# EAGLE design STM32F413CG_WM8731 (EAGLE 9.6.2)

## Sheet 1 of 3
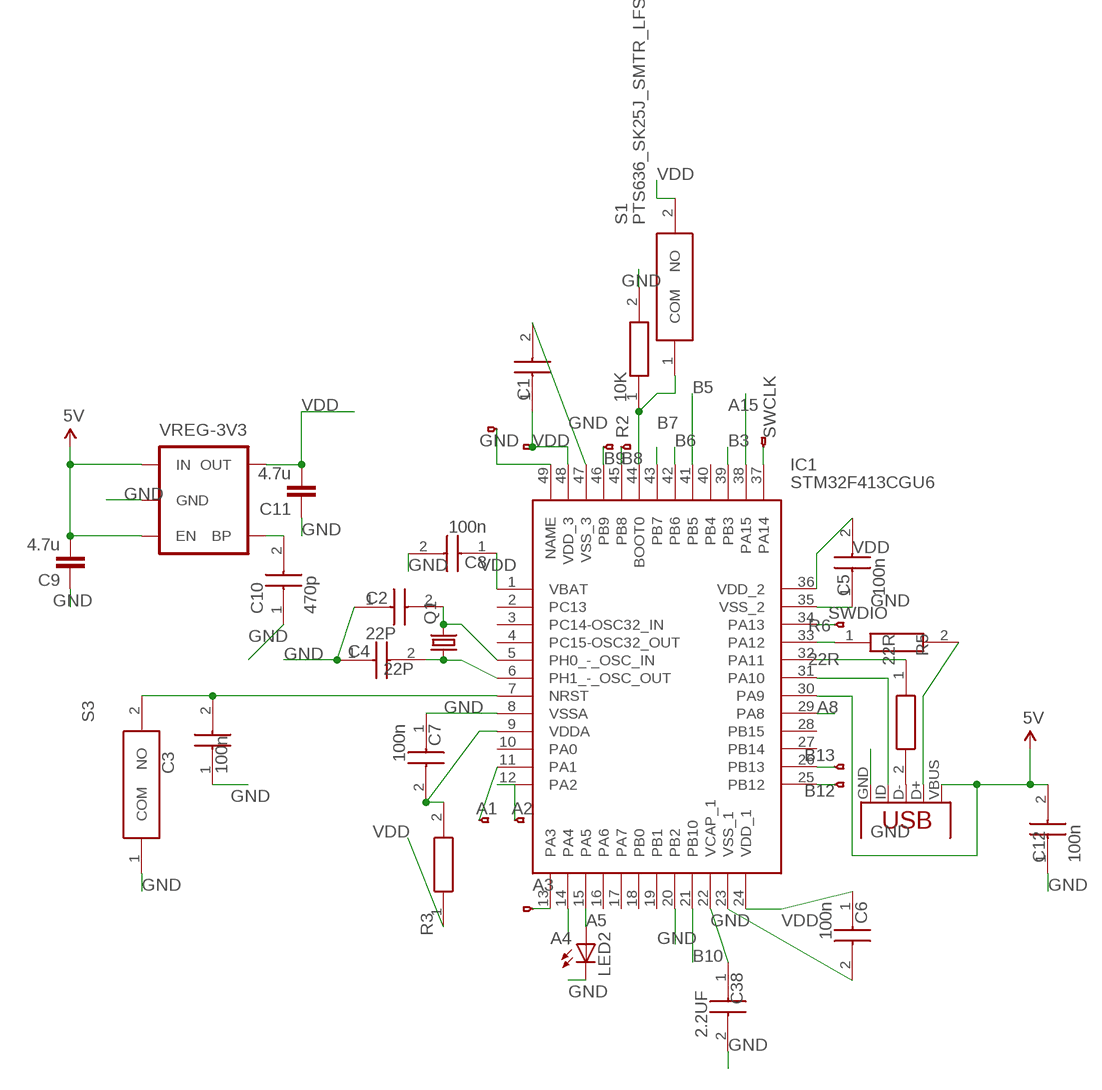
[diagram p0: schematic, sheet 1]

### Parts
C1  C0603C104M4RAC7411  [CAPC1608X95N]
C2  22P  C1608C0G1H150J080AA  [CAPC1608X80N]
C3  100n  C0603C104M4RAC7411  [CAPC1608X95N]
C4  22P  C1608C0G1H150J080AA  [CAPC1608X80N]
C5  100n  C0603C104M4RAC7411  [CAPC1608X95N]
C6  100n  C0603C104M4RAC7411  [CAPC1608X95N]
C7  100n  C0603C104M4RAC7411  [CAPC1608X95N]
C8  100n  C0603C104M4RAC7411  [CAPC1608X95N]
C9  4.7u  C2,5-3  [C2.5-3]
C10  470p  C0603C471K3RACTU  [CAPC1608X87N]
C11  4.7u  C2,5-3  [C2.5-3]
C12  100n  C0603C104M4RAC7411  [CAPC1608X95N]
C38  2.2UF  C2012X7R1E225K125AB  [CAPC2012X145N]
IC1  STM32F413CGU6  [QFN50P700X700X60-49N]
JP1  HEADERHOLE-HEADERHOLE  [1X1-HEADER-HOLE]
JP2  HEADERHOLE-HEADERHOLE  [1X1-HEADER-HOLE]
JP3  HEADERHOLE-HEADERHOLE  [1X1-HEADER-HOLE]
JP4  HEADERHOLE-HEADERHOLE  [1X1-HEADER-HOLE]
JP5  HEADERHOLE-HEADERHOLE  [1X1-HEADER-HOLE]
JP6  HEADERHOLE-HEADERHOLE  [1X1-HEADER-HOLE]
JP7  HEADERHOLE-HEADERHOLE  [1X1-HEADER-HOLE]
JP8  HEADERHOLE-HEADERHOLE  [1X1-HEADER-HOLE]
JP9  HEADERHOLE-HEADERHOLE  [1X1-HEADER-HOLE]
JP10  HEADERHOLE-HEADERHOLE  [1X1-HEADER-HOLE]
JP11  HEADERHOLE-HEADERHOLE  [1X1-HEADER-HOLE]
LED2  LED0603  [LED-0603]
Q1  CRYSTALHC49S  [HC49/S]
R2  10K  CRCW040210K0JNED  [RESC1005X40N]
R3  CRCW040222R0FKED  [RESC1005X40N]
R5  22R  CRCW040222R0FKED  [RESC1005X40N]
R6  22R  CRCW040222R0FKED  [RESC1005X40N]
S1  PTS636_SK25J_SMTR_LFS  [PTS636SK25JSMTRLFS]
S3  PTS636_SK25J_SMTR_LFS  [PTS636SK25JSMTRLFS]
VREG-3V3  V_REG_LDOSMD  [SOT23-5]
X1  USB-MICROB-SMD  [USB-MICROB-SMD]

### Nets
5V: C9.2 C12.2 IC1.30(PA9) VREG-3V3.1(IN) VREG-3V3.3(EN) X1.VBUS
A1: IC1.11(PA1) JP8.1
A2: IC1.12(PA2) JP9.1
A3: IC1.13(PA3) JP10.1
A4: IC1.14(PA4) ; also sheet 2
A5: IC1.15(PA5) LED2.A
A8: IC1.29(PA8) ; also sheet 2
A15: IC1.38(PA15) ; also sheet 3
B3: IC1.39(PB3) ; also sheet 3
B5: IC1.41(PB5) ; also sheet 3
B6: IC1.42(PB6) ; also sheet 3
B7: IC1.43(PB7) ; also sheet 3
B8: IC1.45(PB8) JP5.1
B9: IC1.46(PB9) JP11.1
B10: IC1.21(PB10) ; also sheet 3
B12: IC1.25(PB12) JP7.1
B13: IC1.26(PB13) JP6.1
GND: C1.2 C2.1 C3.1 C4.1 C5.1 C6.2 C7.1 C8.2 C9.1 C10.1 C11.1 C12.1 C38.2 IC1.8(VSSA) IC1.20(PB2) IC1.23(VSS_1) IC1.35(VSS_2) IC1.47(VSS_3) IC1.49(NAME) JP1.1 LED2.C R2.2 S3.1(COM) VREG-3V3.2(GND) X1.GND ; also sheet 2,3
N$1: C2.2 IC1.5(PH0_-_OSC_IN) Q1.2
N$3: C3.2 IC1.7(NRST) S3.2(NO)
N$4: C10.2 VREG-3V3.4(BP)
N$5: C7.2 IC1.9(VDDA) R3.2
N$7: R5.2 X1.D-
N$8: IC1.31(PA10) X1.ID
N$9: IC1.32(PA11) R5.1
N$10: R6.2 X1.D+
N$11: IC1.33(PA12) R6.1
N$13: IC1.44(BOOT0) R2.1 S1.1(COM)
N$19: C4.2 IC1.6(PH1_-_OSC_OUT) Q1.1
N$48: C38.1 IC1.22(VCAP_1)
SWCLK: IC1.37(PA14) JP2.1
SWDIO: IC1.34(PA13) JP3.1
VDD: C1.1 C5.2 C6.1 C8.1 C11.2 IC1.1(VBAT) IC1.24(VDD_1) IC1.36(VDD_2) IC1.48(VDD_3) JP4.1 R3.1 S1.2(NO) VREG-3V3.5(OUT) ; also sheet 2,3
Unconnected: IC1.2(PC13) IC1.3(PC14-OSC32_IN) IC1.4(PC15-OSC32_OUT) IC1.10(PA0) IC1.16(PA6) IC1.17(PA7) IC1.18(PB0) IC1.19(PB1) IC1.27(PB14) IC1.28(PB15) IC1.40(PB4) X1.MT1 X1.MT2 X1.MT3 X1.MT4

## Sheet 2 of 3
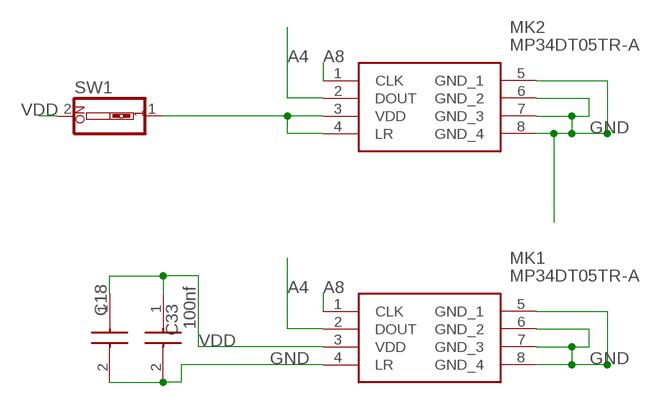
[diagram p1: schematic, sheet 2]

### Parts
C18  1UF  CC0402KRX5R6BB105  [CAPC1005X55N]
C33  100nf  C0603C104M4RAC7411  [CAPC1608X95N]
MK1  MP34DT05TR-A  [MP34DT05TRA]
MK2  MP34DT05TR-A  [MP34DT05TRA]
SW1  SW_DIP-1  [EDG-01]

### Nets
A4: MK1.2(DOUT) MK2.2(DOUT) ; also sheet 1
A8: MK1.1(CLK) MK2.1(CLK) ; also sheet 1
GND: C18.2(C2) C33.2 MK1.4(LR) MK1.5(GND_1) MK1.6(GND_2) MK1.7(GND_3) MK1.8(GND_4) MK2.5(GND_1) MK2.6(GND_2) MK2.7(GND_3) MK2.8(GND_4) ; also sheet 1,3
N$2: MK2.3(VDD) MK2.4(LR) SW1.1
VDD: C18.1(C1) C33.1 MK1.3(VDD) SW1.2 ; also sheet 1,3

## Sheet 3 of 3
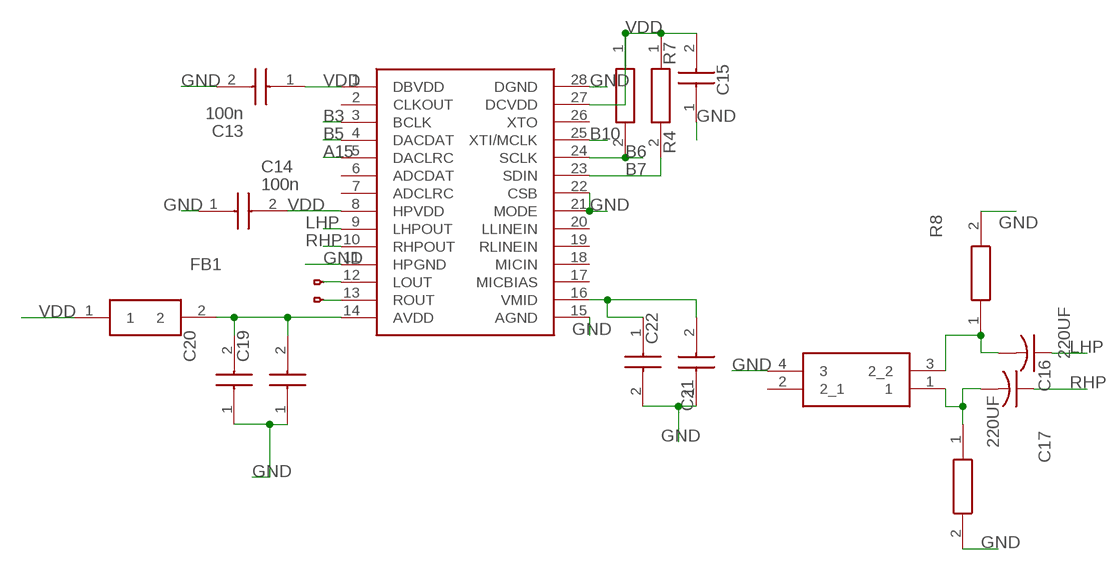
[diagram p2: schematic, sheet 3]

### Parts
C13  100n  C0603C104M4RAC7411  [CAPC1608X95N]
C14  100n  C0603C104M4RAC7411  [CAPC1608X95N]
C15  C0603C104M4RAC7411  [CAPC1608X95N]
C16  220UF  C-US025-024X044  [C025-024X044]
C17  220UF  C-US025-024X044  [C025-024X044]
C19  C0603C104M4RAC7411  [CAPC1608X95N]
C20  CL21A106KAYNNNE_10UF  CL21A106KAYNNNE  [CAPC2012X145N]
C21  CL21A106KAYNNNE  [CAPC2012X145N]
C22  C0603C104M4RAC7411  [CAPC1608X95N]
FB1  BLM18BD252SN1D  [BEADC1608X95N]
IC2  WM8731SEDS_RV  [SOP65P780X200-28N]
J2  1503_02  [150302]
JP12  HEADERHOLE-HEADERHOLE  [1X1-HEADER-HOLE]
JP13  HEADERHOLE-HEADERHOLE  [1X1-HEADER-HOLE]
R4  CR0603-JW-472ELF  [RESC1608X55N]
R7  CR0603-JW-472ELF  [RESC1608X55N]
R8  CR0603-JW-472ELF  [RESC1608X55N]
R9  CR0603-JW-472ELF  [RESC1608X55N]

### Nets
A15: IC2.5(DACLRC) ; also sheet 1
B3: IC2.3(BCLK) ; also sheet 1
B5: IC2.4(DACDAT) ; also sheet 1
B6: IC2.24(SCLK) R4.2 ; also sheet 1
B7: IC2.23(SDIN) R7.2 ; also sheet 1
B10: IC2.25(XTI/MCLK) ; also sheet 1
GND: C13.2 C14.1 C15.1 C19.1 C20.1 C21.2 C22.1 IC2.11(HPGND) IC2.15(AGND) IC2.21(MODE) IC2.22(CSB) IC2.28(DGND) J2.4 R8.2 R9.2 ; also sheet 1,2
LHP: C16.1 IC2.9(LHPOUT)
N$6: C16.2 J2.3(2_2) R8.1
N$12: C19.2 C20.2 FB1.2 IC2.14(AVDD)
N$14: C21.1 C22.2 IC2.16(VMID)
N$15: IC2.12(LOUT) JP13.1
N$16: IC2.13(ROUT) JP12.1
N$25: C17.2 J2.1 R9.1
RHP: C17.1 IC2.10(RHPOUT)
VDD: C13.1 C14.2 C15.2 FB1.1 IC2.1(DBVDD) IC2.8(HPVDD) IC2.27(DCVDD) R4.1 R7.1 ; also sheet 1,2
Unconnected: IC2.2(CLKOUT) IC2.6(ADCDAT) IC2.7(ADCLRC) IC2.17(MICBIAS) IC2.18(MICIN) IC2.19(RLINEIN) IC2.20(LLINEIN) IC2.26(XTO) J2.2(2_1)

## Library data of the parts
C1 C3 C5-C8 C12-C15 C33 = C0603C104M4RAC7411:C0603C104M4RAC7411: KEMET - C0603C104M4RAC7411 - CAP, 0.1F, 16V, 20%, X7R, 0603 Source: Datasheet <https://www.mouser.com/datasheet/2/212/KEM_C1023_X7R_AUTO_SMD-1093309.pdf>; DESCRIPTION: KEMET - C0603C104M4RAC7411 - CAP, 0.1F, 16V, 20%, X7R, 0603; HEIGHT: 0.95mm; MANUFACTURER_NAME: Kemet; MANUFACTURER_PART_NUMBER: C0603C104M4RAC7411; MOUSER_PART_NUMBER: 80-C0603C104M4R7411; MOUSER_PRICE-STOCK: https://www.mouser.com/Search/Refine.aspx?Keyword=80-C0603C104M4R7411
C2 C4 = C1608C0G1H150J080AA_15pF:C1608C0G1H150J080AA: TDK 0603 C 15pF Ceramic Multilayer Capacitor, 50 V dc, +125C, C0G Dielectric, +/-5% SMD Source: Datasheet <https://product.tdk.com/info/en/catalog/datasheets/mlcc_commercial_midvoltage_en.pdf>; DESCRIPTION: TDK 0603 C 15pF Ceramic Multilayer Capacitor, 50 V dc, +125C, C0G Dielectric, +/-5% SMD; HEIGHT: 0.8mm; MANUFACTURER_NAME: TDK; MANUFACTURER_PART_NUMBER: C1608C0G1H150J080AA; MOUSER_PART_NUMBER: 810-C1608C0G1H150J; MOUSER_PRICE-STOCK: https://www.mouser.com/Search/Refine.aspx?Keyword=810-C1608C0G1H150J; RS_PART_NUMBER: 7882935; RS_PRICE-STOCK: https://uk.rs-online.com/web/p/products/7882935
C9 C11 = capacitor-wima:C: CAPACITOR naming: grid - package width
C10 = C0603C471K3RACTU_470pF:C0603C471K3RACTU: KEMET - C0603C471K3RACTU - CAP, X7R, 470PF, 25V, 0603 Source: Datasheet <https://api.kemet.com/component-edge/download/specsheet/C0603C471K3RACTU.pdf>; DESCRIPTION: KEMET - C0603C471K3RACTU - CAP, X7R, 470PF, 25V, 0603; HEIGHT: 0.87mm; MANUFACTURER_NAME: Kemet; MANUFACTURER_PART_NUMBER: C0603C471K3RACTU; MOUSER_PART_NUMBER: 80-C0603C471K3R; MOUSER_PRICE-STOCK: https://www.mouser.com/Search/Refine.aspx?Keyword=80-C0603C471K3R
C16 C17 = rcl:C-US: CAPACITOR, American symbol; SPICEPREFIX: C
C18 = CC0402KRX5R6BB105_1UF:CC0402KRX5R6BB105: CAPACITOR, 0402 1uF +/-10% 10V Source: Datasheet <http://componentsearchengine.com/Datasheets/1/CC0402KRX5R6BB105.pdf>; DESCRIPTION: CAPACITOR, 0402 1uF +/-10% 10V; HEIGHT: mm; MANUFACTURER_NAME: YAGEO (PHYCOMP); MANUFACTURER_PART_NUMBER: CC0402KRX5R6BB105; MOUSER_PART_NUMBER: 603-CC402KRX5R6BB105; MOUSER_PRICE-STOCK: https://www.mouser.com/Search/Refine.aspx?Keyword=603-CC402KRX5R6BB105
C19 C22 = C0603C104M4RAC7411_100nF:C0603C104M4RAC7411: KEMET - C0603C104M4RAC7411 - CAP, 0.1F, 16V, 20%, X7R, 0603 Source: Datasheet <https://www.mouser.com/datasheet/2/212/KEM_C1023_X7R_AUTO_SMD-1093309.pdf>; DESCRIPTION: KEMET - C0603C104M4RAC7411 - CAP, 0.1F, 16V, 20%, X7R, 0603; HEIGHT: 0.95mm; MANUFACTURER_NAME: Kemet; MANUFACTURER_PART_NUMBER: C0603C104M4RAC7411; MOUSER_PART_NUMBER: 80-C0603C104M4R7411; MOUSER_PRICE-STOCK: https://www.mouser.com/Search/Refine.aspx?Keyword=80-C0603C104M4R7411
C20 C21 = CL21A106KAYNNNE_10uF:CL21A106KAYNNNE: Samsung Source: Datasheet <http://www.samsungsem.com/kr/support/library/product-catalog/__icsFiles/afieldfile/2017/09/13/MLCC.pdf>; DESCRIPTION: Samsung; HEIGHT: 1.45mm; MANUFACTURER_NAME: Samsung Electro-Mechanics; MANUFACTURER_PART_NUMBER: CL21A106KAYNNNE; MOUSER_PART_NUMBER: N/A; MOUSER_PRICE-STOCK: https://www.mouser.com/Search/Refine.aspx?Keyword=N%2FA
C38 = C2012X7R1E225K125AB:C2012X7R1E225K125AB: TDK - C2012X7R1E225K125AB - CAPACITOR, MLCC, X7R, 2.2UF, 25V, 0805 Source: Datasheet <https://product.tdk.com/info/en/catalog/datasheets/mlcc_commercial_midvoltage_en.pdf>; DESCRIPTION: TDK - C2012X7R1E225K125AB - CAPACITOR, MLCC, X7R, 2.2UF, 25V, 0805; HEIGHT: 1.45mm; MANUFACTURER_NAME: TDK; MANUFACTURER_PART_NUMBER: C2012X7R1E225K125AB; MOUSER_PART_NUMBER: 810-C2012X7R1E225K; MOUSER_PRICE-STOCK: https://www.mouser.com/Search/Refine.aspx?Keyword=810-C2012X7R1E225K; RS_PART_NUMBER: 9159394P; RS_PRICE-STOCK: http://uk.rs-online.com/web/p/products/9159394P
FB1 = BLM18BD252SN1D_Ferrite Bead:BLM18BD252SN1D: 0603 Ferrite Bead,2K5,25%,50mA,1R5 Murata Ferrite Bead (Chip Ferrite Bead), 1.6 x 0.8 x 0.8mm (0603), 2500 impedance at 100 MHz Source: Datasheet <http://www.murata.com/~/media/webrenewal/support/library/catalog/products/emc/emifil/c31e.ashx?la=en-gb>; DESCRIPTION: 0603 Ferrite Bead,2K5,25%,50mA,1R5 Murata Ferrite Bead (Chip Ferrite Bead), 1.6 x 0.8 x 0.8mm (0603), 2500 impedance at 100 MHz; HEIGHT: 0.95mm; MANUFACTURER_NAME: Murata Electronics; MANUFACTURER_PART_NUMBER: BLM18BD252SN1D; MOUSER_PART_NUMBER: 81-BLM18BD252SN1D; MOUSER_PRICE-STOCK: https://www.mouser.com/Search/Refine.aspx?Keyword=81-BLM18BD252SN1D; RS_PART_NUMBER: 7241321P; RS_PRICE-STOCK: http://uk.rs-online.com/web/p/products/7241321P
IC1 = STM32F413CG_edited:STM32F413CGU6: STMICROELECTRONICS - STM32F413CGU6 - MCU, ARM CORTEX-M4, 100MHZ, UFQFPN-48 Source: Datasheet <http://www.st.com/content/ccc/resource/technical/document/datasheet/group3/f6/1d/4a/d9/f9/96/43/2a/DM00282249/files/DM00282249.pdf/jcr:content/translations/en.DM00282249.pdf>; DESCRIPTION: STMICROELECTRONICS - STM32F413CGU6 - MCU, ARM CORTEX-M4, 100MHZ, UFQFPN-48; HEIGHT: 0.6mm; MANUFACTURER_NAME: STMicroelectronics; MANUFACTURER_PART_NUMBER: STM32F413CGU6; MOUSER_PART_NUMBER: 511-STM32F413CGU6; MOUSER_PRICE-STOCK: https://www.mouser.com/Search/Refine.aspx?Keyword=511-STM32F413CGU6
IC2 = WM8731SEDS_RV_1:WM8731SEDS_RV: WOLFSON MICROELECTRONICS - WM8731SEDS/RV - DAC, AUDIO, 24BIT, HEADPHONE, 28SSOP Source: Datasheet <https://d3uzseaevmutz1.cloudfront.net/pubs/proDatasheet/WM8731_v4.9.pdf>; DESCRIPTION: WOLFSON MICROELECTRONICS - WM8731SEDS/RV - DAC, AUDIO, 24BIT, HEADPHONE, 28SSOP; HEIGHT: 2mm; MANUFACTURER_NAME: WOLFSON MICROELECTRONICS; MANUFACTURER_PART_NUMBER: WM8731SEDS/RV
J2 = 1503_02:1503_02: LUMBERG - 1503 02 - CONNECTOR, RECEPTACLE, 3.5MM PHONO, 3WAY Source: Datasheet <http://www.farnell.com/datasheets/2047485.pdf>; DESCRIPTION: LUMBERG - 1503 02 - CONNECTOR, RECEPTACLE, 3.5MM PHONO, 3WAY; HEIGHT: 5mm; MANUFACTURER_NAME: LUMBERG; MANUFACTURER_PART_NUMBER: 1503 02
JP1-JP13 = F405Pill:HEADERHOLE
LED2 = F405Pill:LED: LEDs Standard schematic elements and footprints for 5mm, 3mm, 1206, and 0603 sized LEDs. 5mm - Spark Fun Electronics SKU : COM-00529 (and others)
MK1 MK2 = MP34DT05TR-A:MP34DT05TR-A: STMICROELECTRONICS - MP34DT05TR-A - MEMS MICROPHONE, 3.6V, HCLGA-4 Source: Datasheet <http://www.st.com/content/ccc/resource/technical/document/datasheet/group3/c7/90/d3/f6/b7/e7/40/c8/DM00415595/files/DM00415595.pdf/jcr:content/translations/en.DM00415595.pdf>; DESCRIPTION: STMICROELECTRONICS - MP34DT05TR-A - MEMS MICROPHONE, 3.6V, HCLGA-4; HEIGHT: 1mm; MANUFACTURER_NAME: STMicroelectronics; MANUFACTURER_PART_NUMBER: MP34DT05TR-A; MOUSER_PART_NUMBER: 511-MP34DT05TR-A; MOUSER_PRICE-STOCK: https://www.mouser.com/Search/Refine.aspx?Keyword=511-MP34DT05TR-A
Q1 = crystal:CRYSTAL: CRYSTAL; OC_FARNELL: 1667008; OC_NEWARK: unknown
R2 = CRCW040210K0JNED:CRCW040210K0JNED: Thick Film Resistors - SMD 1/16watt 10Kohms 5% Source: Datasheet <http://www.vishay.com/docs/20035/dcrcwe3.pdf>; ALLIED_NUMBER: 70202522; ALLIED_PRICE-STOCK: https://www.alliedelec.com/vishay-dale-crcw040210k0jned/70202522/; DESCRIPTION: Thick Film Resistors - SMD 1/16watt 10Kohms 5%; HEIGHT: 0.4mm; MANUFACTURER_NAME: Vishay; MANUFACTURER_PART_NUMBER: CRCW040210K0JNED; MOUSER_PART_NUMBER: 71-CRCW0402J-10K-E3; MOUSER_PRICE-STOCK: https://www.mouser.com/Search/Refine.aspx?Keyword=71-CRCW0402J-10K-E3
R3 R5 R6 = CRCW040222R0FKED_22R:CRCW040222R0FKED: Vishay CRCW Series Thick Film Surface Mount Resistor 0402 Case 22 +/-1% 0.063W +/-100ppm/C Source: Datasheet <http://www.vishay.com/docs/20035/dcrcwe3.pdf>; ALLIED_NUMBER: 70202113; ALLIED_PRICE-STOCK: https://www.alliedelec.com/vishay-dale-crcw040222r0fked/70202113/; DESCRIPTION: Vishay CRCW Series Thick Film Surface Mount Resistor 0402 Case 22 +/-1% 0.063W +/-100ppm/C; HEIGHT: 0.4mm; MANUFACTURER_NAME: Vishay; MANUFACTURER_PART_NUMBER: CRCW040222R0FKED; MOUSER_PART_NUMBER: 71-CRCW0402-22-E3; MOUSER_PRICE-STOCK: https://www.mouser.com/Search/Refine.aspx?Keyword=71-CRCW0402-22-E3; RS_PART_NUMBER: 6788983P; RS_PRICE-STOCK: http://uk.rs-online.com/web/p/products/6788983P
R4 R7-R9 = CR0603-JW-472ELF:CR0603-JW-472ELF: BOURNS - CR0603-JW-472ELF - RES, THICK FILM, 4K7, 5%, 0.1W, 0603, REEL Source: Datasheet <https://www.bourns.com/pdfs/chpreztr.pdf>; ALLIED_NUMBER: 70154691; ALLIED_PRICE-STOCK: https://www.alliedelec.com/bourns-cr0603-jw-472elf/70154691/; DESCRIPTION: BOURNS - CR0603-JW-472ELF - RES, THICK FILM, 4K7, 5%, 0.1W, 0603, REEL; HEIGHT: 0.55mm; MANUFACTURER_NAME: Bourns; MANUFACTURER_PART_NUMBER: CR0603-JW-472ELF; MOUSER_PART_NUMBER: 652-CR0603-JW-472ELF; MOUSER_PRICE-STOCK: https://www.mouser.com/Search/Refine.aspx?Keyword=652-CR0603-JW-472ELF; RS_PART_NUMBER: 7408956P; RS_PRICE-STOCK: http://uk.rs-online.com/web/p/products/7408956P
S1 S3 = PTS636_SK25J_SMTR_LFS_tactSwitch6x3x2:PTS636_SK25J_SMTR_LFS: Tactile Switches Tact 50mA 12VDC, 6.0x3.5, 2.5mm H, 250gf, J leads, No ground pin, Red Actuator Source: Datasheet <https://www.mouser.com/datasheet/2/60/pts636-1550567.pdf>; DESCRIPTION: Tactile Switches Tact 50mA 12VDC, 6.0x3.5, 2.5mm H, 250gf, J leads, No ground pin, Red Actuator; HEIGHT: 2.7mm; MANUFACTURER_NAME: C & K COMPONENTS; MANUFACTURER_PART_NUMBER: PTS636 SK25J SMTR LFS; MOUSER_PART_NUMBER: 611-PTS636SK25JSMTRL; MOUSER_PRICE-STOCK: https://www.mouser.com/Search/Refine.aspx?Keyword=611-PTS636SK25JSMTRL
SW1 = special:SW_DIP-1: DIP SWITCH
VREG-3V3 = F405Pill:V_REG_LDO: Voltage Regulator LDO Standard 150mA LDO voltage regulator in SOT-23 layout. Micrel part MIC5205. BP (by-pass) pin is used to lower output noise with 470pF cap.
X1 = F405Pill:USB: USB Connectors USB-B-PTH is fully proven SKU : PRT-00139 USB-miniB is fully proven SKU : PRT-00587 USB-A-PCB is untested. USB-A-H is throughly reviewed, but untested. Spark Fun Electronics SKU : PRT-00437 USB-B-SMT is throughly reviewed, but untested. Needs silkscreen touching up. USB-A-S has not been used/tested USB-MB-H has not been used/tested

## Net classes
0 default: width 0.254 mm, drill 0.35 mm

## Board
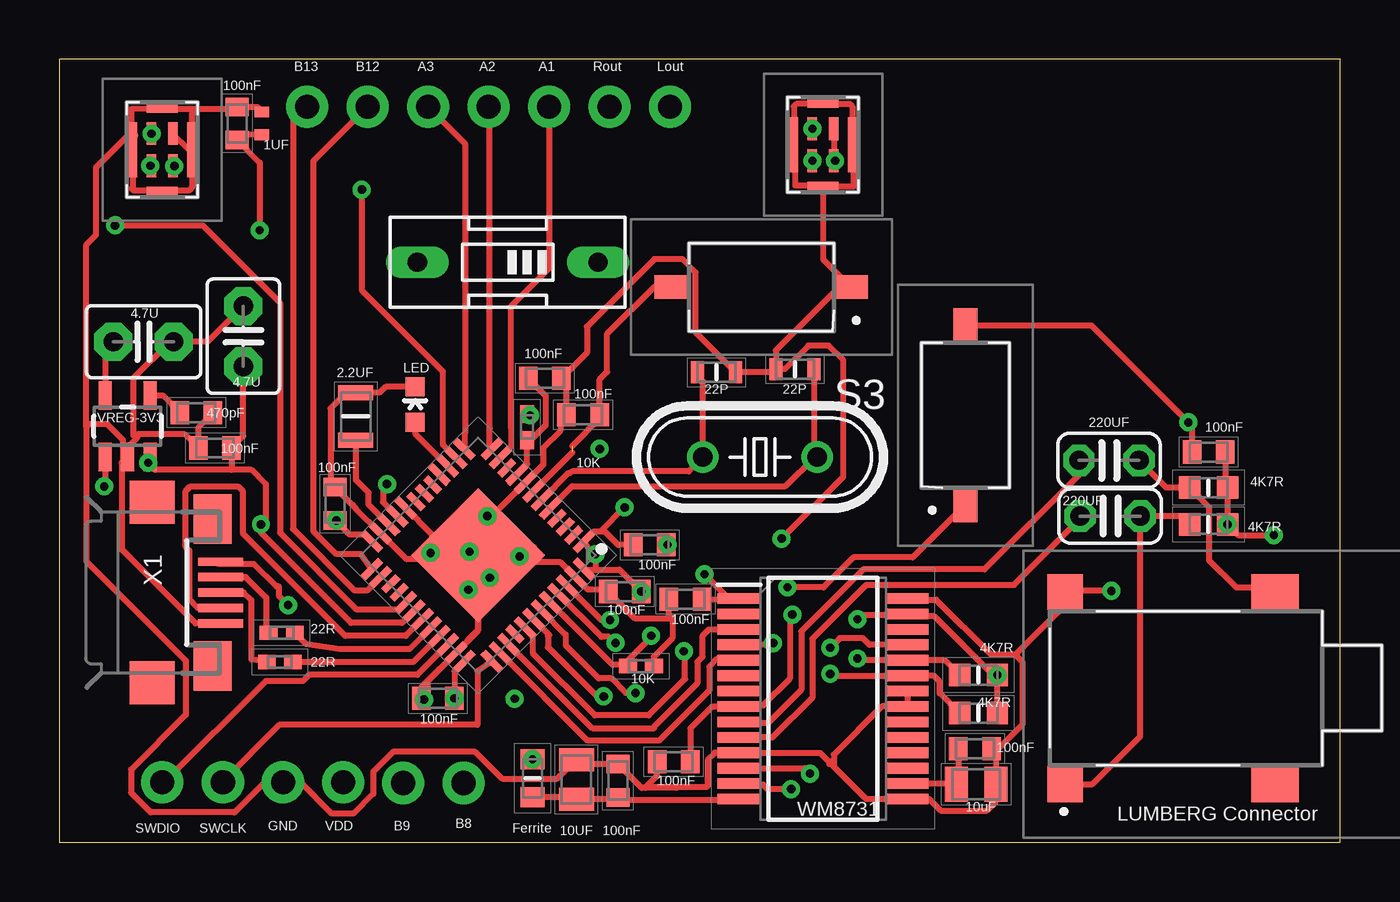
[diagram p3: board, top side]
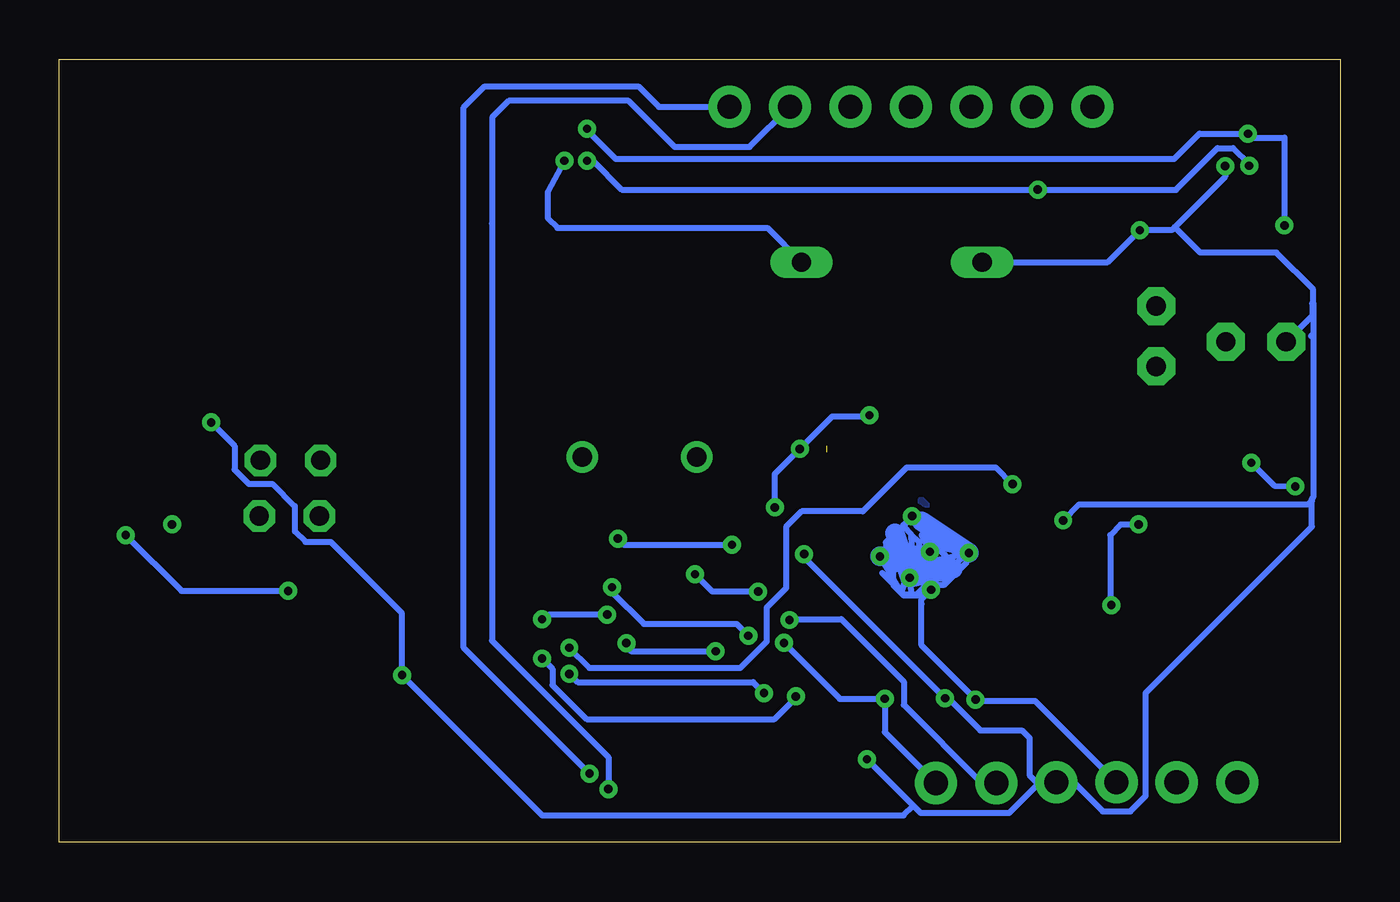
[diagram p4: board, bottom side, seen from below]

Size 54 x 33 mm. Coordinates in mm from the lower left corner, seen from the top.
Outline: 0,0 54,0 54,33 0,33 0,0
Copper layers (1*16): Top 0.035mm / dielectric 1.5mm / Bottom 0.035mm
Design rules "default *": minimum track width 6mil, minimum drill 0.35mm, track to track 0.2mm, track to pad 0.2mm, pad to pad 0.2mm, via to via 0.2mm, smd to smd 6mil, copper to edge 40mil, drill to drill 6mil, minimum pad ring 10mil, minimum via ring 8mil, stop-mask expansion 4mil, vias tented up to drill 0mil, thermal gap 10mil

### Footprints (pad centres in the part's own frame; a part is rotated, then mirrored left to right if it is on the bottom)
CAPC1608X95N = smd 0.78 x 0.98: 1 -0.7,0; 2 0.7,0
CAPC1608X80N = smd 0.54 x 0.94: 1 -0.8,0; 2 0.8,0
C2.5-3 = drill 0.813 pad 1.6 octagon: 1 -1.27,0; 2 1.27,0
CAPC1608X87N = smd 0.78 x 0.98: 1 -0.7,0; 2 0.7,0
C025-024X044 = drill 0.813 octagon: 1 -1.27,0; 2 1.27,0
CAPC1005X55N = smd 0.457 x 0.61: 1 -0.483,0; 2 0.483,0
CAPC2012X145N = smd 0.97 x 1.47: 1 -0.83,0; 2 0.83,0
CAPC2012X145N' = smd 0.62 x 1.47: 1 -1,0; 2 1,0
BEADC1608X95N = smd 0.85 x 1: 1 -0.8,0; 2 0.8,0
QFN50P700X700X60-49N = smd 1.08 x 0.3: 1 -3.57,2.75; 5 -3.567,0.75; 6 -3.567,0.25; 7 -3.567,-0.25; 8 -3.567,-0.75; 9 -3.567,-1.25; 11 -3.567,-2.25; 12 -3.59,-2.75; 25 3.59,-2.75; 26 3.567,-2.25; 29 3.567,-0.75; 30 3.567,-0.25; 31 3.567,0.25; 32 3.567,0.75; 33 3.567,1.25; 34 3.567,1.75; 35 3.567,2.25; 36 3.58,2.75 | smd 0.85 x 0.3: 2 -3.45,2.25; 3 -3.45,1.75; 4 -3.45,1.25; 10 -3.45,-1.75; 27 3.45,-1.75; 28 3.45,-1.25 | smd 0.3 x 1.08: 13 -2.75,-3.59; 14 -2.25,-3.567; 15 -1.75,-3.567; 16 -1.25,-3.567; 20 0.75,-3.567; 21 1.25,-3.567; 22 1.75,-3.567; 23 2.25,-3.567; 24 2.75,-3.59; 37 2.75,3.58; 38 2.25,3.567; 39 1.75,3.567; 41 0.75,3.567; 42 0.25,3.567; 43 -0.25,3.567; 44 -0.75,3.567; 45 -1.25,3.567; 46 -1.75,3.567; 47 -2.25,3.567; 48 -2.75,3.57 | smd 0.3 x 0.85: 17 -0.75,-3.45; 18 -0.25,-3.45; 19 0.25,-3.45; 40 1.25,3.45 | smd 4 x 4: 49 0,0
SOP65P780X200-28N = smd 1.8 x 0.45: 1 -3.55,4.225; 2 -3.55,3.575; 3 -3.55,2.925; 4 -3.55,2.275; 5 -3.55,1.625; 6 -3.55,0.975; 7 -3.55,0.325; 8 -3.55,-0.325; 9 -3.55,-0.975; 10 -3.55,-1.625; 11 -3.55,-2.275; 12 -3.55,-2.925; 13 -3.55,-3.575; 14 -3.55,-4.225; 15 3.55,-4.225; 16 3.55,-3.575; 17 3.55,-2.925; 18 3.55,-2.275; 19 3.55,-1.625; 20 3.55,-0.975; 21 3.55,-0.325; 22 3.55,0.325; 23 3.55,0.975; 24 3.55,1.625; 25 3.55,2.275; 26 3.55,2.925; 27 3.55,3.575; 28 3.55,4.225
150302 = smd 1.5 x 1.5: 1 6.3,3.8; 4 6.3,-4.3 | smd 2 x 1.5: 2 -2.55,3.8; 3 -2.55,-4.3
1X1-HEADER-HOLE = drill 1.016 pad 1.778: 1 0,0
LED-0603 = smd 0.8 x 0.8: A 0,-0.75; C 0,0.75
MP34DT05TRA = smd 0.4 x 0.95: 1 -0.45,0.675; 2 -0.45,-0.675; 3 0.45,-0.675; 4 0.45,0.675 | smd 0.35 x 2.3: 5 -1.225,0; 6 1.225,0 | smd 1.3 x 0.35: 7 0,1.725; 8 0,-1.725
HC49/S = drill 0.813: 1 -2.413,0; 2 2.413,0
RESC1005X40N = smd 0.75 x 0.6: 1 -0.55,0; 2 0.55,0
RESC1608X55N = smd 0.9 x 0.95: 1 -0.8,0; 2 0.8,0
PTS636SK25JSMTRLFS = smd 1.45 x 1: 1 -3.775,0; 2 3.775,0
EDG-01 = drill 0.813 long: 1 0,-3.81; 2 0,3.81
SOT23-5 = smd 0.55 x 1.2: 1 -0.95,-1.3; 2 0,-1.3; 3 0.95,-1.3; 4 0.95,1.3; 5 -0.95,1.3
USB-MICROB-SMD = smd 0.35 x 1.9: D+ 0,2.9; D- -0.65,2.9; GND 1.3,2.9; ID 0.65,2.9; VBUS -1.3,2.9 | smd 1.8 x 1.9: MT1 -3.8,0; MT2 3.8,0 | smd 2.1 x 1.6: MT3 -3.1,2.55; MT4 3.1,2.55

### Placement (x,y rotation side)
C1  23.84,10.57 180 top
C2  31.01,19.94 0 top
C3  22.08,18.02 0 top
C4  27.71,19.81 180 top
C5  15.96,6.07 0 top
C6  11.63,14.27 90 top
C7  20.47,19.56 180 top
C8  24.89,12.54 0 top
C9  7.76,21.33 270 top
C10  5.78,18.11 180 top
C11  3.55,21.1 180 top
C12  6.56,16.62 0 top
C13  26.4,10.25 180 top
C14  25.9,3.4 0 top
C15  48.45,16.45 180 top
C16  44.25,16.1 0 top
C17  44.3,13.75 0 top
C18  8.55,30.3 90 top
C19  23.55,2.6 270 top
C20  21.8,2.65 270 top
C21  38.65,2.45 0 top
C22  38.6,3.95 180 top
C33  7.5,30.3 90 top
C38  2.2UF  [CAPC2012X145N']  12.5,17.95 90 top
FB1  19.95,2.7 270 top
IC1  17.65,12.1 225 top
IC2  32.2,6.05 0 top
J2  48.7,6.25 180 top
JP1  9.43,2.53 270 top
JP2  6.9,2.53 270 top
JP3  4.34,2.53 270 top
JP4  11.97,2.53 90 top
JP5  17.05,2.5 0 top
JP6  10.45,31 0 top
JP7  13,31 0 top
JP8  20.65,31 0 top
JP9  18.1,31 0 top
JP10  15.55,31 0 top
JP11  14.5,2.5 0 top
JP12  23.2,31 0 top
JP13  25.75,31 0 top
LED2  15,18.45 0 top
MK1  4.34,29.19 0 top
MK2  32.2,29.4 0 top
Q1  29.54,16.24 0 top
R2  24.52,7.43 0 top
R3  19.72,17.5 270 top
R4  38.75,7.05 180 top
R5  9.38,8.83 180 top
R6  9.3,7.6 180 top
R7  38.75,5.45 180 top
R8  48.45,14.95 0 top
R9  48.45,13.4 0 top
S1  38.2,18 90 top
S3  29.6,23.4 180 top
SW1  18.9,24.45 90 top
VREG-3V3  2.88,17.54 0 top
X1  3.91,10.53 270 top

### Tracks (layer width: path | path; a pad name or v marks a point on that pad's centre or on a via)
5V  (via drill 0.35)
  Top 0.254: IC1.30 15.03,9.84 14.45,9.26 12.29,9.26 8.5,13.05 v8.5,13.4 8.7,13.6 8.7,15.1 8.1,15.7 7.26,15.7 | v9.65,10 9.25,10.4 9.25,10.78 9.16,10.78 8.21,11.73 6.71,11.73 X1.VBUS | 7.26,15.7 4.05,15.7 v3.75,16 3.91,16.16 VREG-3V3.3 | VREG-3V3.1 1.93,15.19 v1.89,15 | C9.2 7.76,17.12 C12.2 7.26,15.7
  Bottom 0.254: v8.5,13.4 9.25,13.4 9.7,12.95 9.7,10.05 v9.65,10 | v3.75,16 2.78,15.03 v1.9,15.01 v1.89,15
A1
  Top 0.254: JP8.1 20.65,24.2 19.05,22.6 19.05,17.45 19.06,17.44 19.06,16.72 19.05,16.71 19.05,16.68 IC1.11
A2
  Top 0.254: JP9.1 18.05,30.95 18.14,30.86 18.14,17.45 18.14,16.68 | 18.14,16.68 18.14,16.57 | IC1.12 18.14,16.68
A3
  Top 0.254: 17.1,16.63 17.1,16.57 | JP10.1 17.1,29.45 17.1,17.25 17.1,16.63 | IC1.13 17.1,16.63
A4  (via drill 0.35)
  Top 0.254: IC1.14 16.17,16.76 16.17,19.85 12.75,23.27 v12.75,27.51 | MK1.2 v3.84,28.52
  Bottom 0.254: v31.75,28.73 31.5,28.73 30.29,27.51 v12.75,27.51 12.57,27.51 12.64,27.5 6.93,27.5 5.17,29.26 4.53,29.26 3.84,28.57 v3.84,28.52
A5
  Top 0.254: IC1.15 16.45,15.78 15,17.23 LED2.A
A8  (via drill 0.35)
  Top 0.254: IC1.29 14.68,10.19 14.3,9.81 12.54,9.81 9.3,13.05 9.3,22.74 6.04,26 v2.35,26
  Bottom 0.254: v2.35,26 2.35,29.7 3.73,29.7 v3.89,29.86 5.93,29.86 7,28.8 30.55,28.8 31.9,30.15 31.82,30.15 MK2.1
  other vias: 31.75,30.07
A15
  Top 0.254: 18.6,7.97 22.27,4.29 25.29,4.29 27.4,6.4 27.4,7.4 27.73,7.73 28.6,7.73 IC2.5 | IC1.38 18.6,7.97 | 18.6,7.97
B3
  Top 0.254: IC1.39 18.85,8.42 22.46,4.81 25.09,4.81 25.09,4.89 26.9,6.7 26.9,7.61 27.12,7.83 27.12,8.72 27.38,8.98 IC2.3
B5  (via drill 0.35)
  Top 0.254: 19.84,8.85 IC1.41 19.96,8.73 19.96,7.98 22.59,5.36 24.84,5.36 26.38,6.89 26.38,7.83 | IC2.4 30.07,8.32 30.12,8.37 v30.09,8.4 | 26.38,7.83 26.33,7.78 v26.33,8.06 | 26.38,7.83 26.45,7.9
  Bottom 0.254: v26.33,8.06 29.91,8.06 30.25,8.4 v30.09,8.4
B6  (via drill 0.35)
  Top 0.254: v33.65,7.75 33.73,7.67 IC2.24 37.33,7.67 R4.2 | IC1.42 20.65,8.75 20.6,8.7 20.6,8.21 22.66,6.15 v22.95,6.15
  Bottom 0.254: v33.65,7.75 33.21,7.31 33.21,6.63 31.77,5.19 23.84,5.19 22.95,6.08 v22.95,6.15
B7  (via drill 0.35)
  Top 0.254: v32.5,7.1 32.6,7 35.73,7 IC2.23 36.87,7.03 37.12,6.77 37.12,6.28 R7.2 | IC1.43 21.35,8.75 21.35,8.3 22.74,6.91 23.27,6.91 23.89,6.29 v24.29,6.29
  Bottom 0.254: v32.5,7.1 32.15,6.75 24.75,6.75 v24.29,6.29
B8  (via drill 0.35)
  Top 0.254: IC1.45 20.97,10.54 22.85,8.66 23.19,8.66 v23.45,8.4
  Bottom 0.254: v23.45,8.4 21.09,6.05 v19.2,6.05 19.2,4.65 JP5.1
B9  (via drill 0.35)
  Top 0.254: v23.22,9.37 22.86,9.37 IC1.46
  Bottom 0.254: v23.22,9.37 23.18,9.41 21.03,9.41 18.39,6.77 18.39,5.79 15.1,2.5 JP11.1
B10  (via drill 0.35)
  Top 0.254: 14.02,13.96 IC1.21 13.64,14.34 13.64,14.93 v13.82,15.1 13.84,15.13 14,15.28 | IC2.25 34.16,8.32 33.87,8.61 32.91,8.61 v32.5,8.2
  Bottom 0.254: v13.82,15.1 14.52,15.8 18.27,15.8 20.12,13.95 22.71,13.95 23.36,13.3 23.36,10.71 24.18,9.89 24.18,8.46 25.29,7.35 31.65,7.35 v32.5,8.2
B12
  Top 0.254: JP7.1 10.71,28.71 10.71,13.11 11.67,12.15 12.72,12.15 IC1.25
B13
  Top 0.254: 10.25,30.8 JP6.1 10.1,31 9.85,30.75 9.85,13.21 12.46,10.61 12.97,10.61 IC1.26
GND  (via drill 0.35)
  Top 0.254: X1.GND 6.77,9.23 6.76,9.23 5.74,9.23 2.63,12.34 2.63,15.98 2.68,16.04 | 2.88,16.65 3.28,17.05 3.28,17.14 | 2.88,16.65 VREG-3V3.2 2.68,16.04 | MK1.4 5.46,29.19 MK1.6 5.6,29.23 | 15.7,12.99 IC1.20 | 17.2,12.1 16.55,12.1 | 16.55,12.1 16.29,12.1 16.29,12.35 16.01,12.06 16.01,11.98 14.63,11.93 | 15.7,12.99 15.7,12.95 16.55,12.1 | 16.85,8.12 | 16.85,8.12 IC1.35 17.13,8.4 | 17.65,11.8 17.65,8.92 | 17.65,8.92 16.85,8.12 | 20,11.8 21.13,11.8 IC1.47 22.28,10.65 23.06,10.65 C1.2 | 20,11.8 17.65,11.8 | 18.17,13.68 IC1.8 20.4,15.91 20.4,16.62 21.13,17.35 21.13,17.77 C3.1 21.38,19.35 C7.1 22.24,20.63 22.24,21.74 25.08,24.58 26.27,24.58 26.83,24.02 26.83,21.49 C4.1 30.08,19.81 C2.1 | 18.17,13.68 17.2,12.71 17.2,12.3 | 17.2,12.3 17.2,12.1 | C1.2 22.99,10.5 | 3.2,29.8 3.05,29.73 3.05,29.95 | MK2.8 31.02,27.68 31.02,29.35 MK2.5 30.97,31.02 31.08,31.12 MK2.7 33.32,31.12 33.43,31.02 MK2.6 | MK2.6 | 3.05,29.95 3.05,30.9 MK1.7 5.68,30.91 | 15,19.32 LED2.C 13.75,19.2 | 17.13,8.4 | 17.13,8.4 15.53,6.8 15.53,5.99 v15.37,6.02 15.31,6.02 C5.1 15.26,6.53 16.85,8.12 | 17.63,8.93 17.63,8.9 | 17.63,8.93 17.63,9.64 17.25,10.02 | 17.63,8.93 17.21,8.51 | 17.23,8.5 17.63,8.9 | 5.68,30.91 5.75,30.85 5.6,30.7 5.6,29.23 | MK1.5 3.12,27.61 3.05,27.55 3.13,27.46 MK1.8 5.46,27.46 5.6,27.6 5.6,29.23 | 1.14,17.5 1.14,11.84 5.33,7.66 5.33,5.37 3.02,3.06 3.02,2.1 3.86,1.26 7.38,1.26 8.65,2.53 JP1.1 10.17,2.53 11.49,1.21 12.4,1.21 13.23,2.04 13.23,2.98 14.07,3.82 17.53,3.82 18.67,2.68 20.98,2.68 C20.1 | 2.68,16.45 2.68,16.97 2.02,17.62 1.26,17.62 1.14,17.5 | 2.68,16.45 2.68,16.04 | 2.88,16.65 2.68,16.45 | 3.28,17.14 3.28,17.19 5.29,17.19 C12.1 5.86,17.49 C10.1
  Top 0.254: 3.28,17.14 3.13,17.14 3.13,19.56 4.67,21.1 C11.1 6.26,21.1 C9.1 | C20.1 | 39.33,3.92 39.48,3.77 C21.2 39.48,1.72 39.1,1.34 37.17,1.34 36.68,1.82 IC2.15 34.02,1.82 32.65,3.19 | 39.33,3.92 C22.1 | IC2.22 IC2.21 34.68,5.73 32.65,3.7 32.65,3.5 | C20.1 21.84,3.54 22.08,3.3 C19.1 24.55,2.3 24.7,2.3 | 32.65,3.19 32.07,3.77 29.52,3.77 | 29.52,3.77 29.52,3.78 27.63,3.78 27.33,3.47 27.33,2.38 27.28,2.33 24.97,2.33 | 26,2.3 24.7,2.3 | IC2.11 29.52,3.77 | 32.65,3.5 32.45,3.29 | 13.75,19.2 | C14.1 25.2,2.8 24.85,2.45 | 48.95,16.25 C15.1 49.15,15.05 R8.2 R9.2 49.7,12.95 v51.2,12.95 | R2.2 25.07,7.83 25.85,8.61 25.85,9.45 25.7,9.45 | 25.7,9.45 C13.2 | IC2.28 35.8,10.23 36.97,10.23 39.29,7.9 40.32,7.9 | 25.7,9.45 24.26,9.45 C1.2 | 32.65,3.5 32.65,3.19 | 40.32,7.9 40.6,7.62 40.6,4.95 39.58,3.92 39.33,3.92 | 5.68,30.91 7.42,30.91 C33.2 8.33,31 C18.2 | 1.14,17.5 1.14,25.19 1.55,25.6 1.55,28.45 3.05,29.95 | MK2.8 32.2,24.57 S3.1 32.88,23.4 30.21,20.73 C2.1 | 13.75,19.2 13.5,18.95 C38.2 12.1,18.95 11.44,18.29 11.44,15.16 C6.2 11.63,14.94 12.33,14.24 12.34,14.24 12.5,14.08 12.5,14.07 IC1.23 14.63,11.93 | C2.1 30.57,19.94 31.57,20.94 32.45,20.94 33.05,20.34 33.05,15.4 v30.45,12.8 | 17.4,12.1 17.2,12.1 | IC1.49 17.4,12.1 | 17.4,12.1 17.2,12.3 | MK2.8 32.23,27.65 33.5,27.65 33.5,29.33 MK2.6 | 24.97,2.33 24.9,2.33 | 24.7,2.3 24.85,2.45 | 24.85,2.45 24.97,2.33 | 17.6,10.3 v17.25,10.65 | v25.64,12.54 C8.2 | 15.7,12.99 15.78,12.9 15.95,12.9 | IC1.49 18,12.45 20,12.45 | 17.63,8.9 17.65,8.92 | 18.16,13.05 18.17,13.07 18.17,13.68 | 18.16,13.05 17.75,12.64 17.75,12.2 IC1.49 | 18.16,13.05 18.74,13.05 20,11.8 | 14.63,11.93 17.45,12.09 IC1.49
  Top 0.254: IC1.49 17.65,11.8 | 40.32,7.9 42.4,9.99 J2.4 42.45,10.6 v44.35,10.6
  Bottom 0.254: JP1.1 12.87,5.97 15.32,5.97 | v15.37,6.02 15.32,5.97 | v30.45,12.8 30.19,12.54 v25.64,12.54 | 15.32,5.97 17.65,8.3 17.65,10.05 | 17.67,10.08 17.65,10.05 | 17.25,10.64 v17.25,10.65 17.5,10.4 18.05,10.4 | 17.65,10.05 17.65,10.24 | 17.65,10.24 17.25,10.64 | 18.44,10.45 18.4,10.4 18.05,10.4 | 19.3,11.35 18.95,11 | 18.95,11 18.86,10.9 | 17.5,11.5 17.45,11.44 | v19.4,12.05 19.15,11.8 | 19.15,11.8 19.11,11.8 | 19.15,11.8 18.95,11.6 18.95,11.45 | 18.95,11.45 18.95,11.3 | 18.95,11.3 18.95,11 | v15.65,12.2 15.74,12.11 15.74,11.81 16.23,11.33 | 16.53,11.03 16.71,10.85 17.04,10.85 17.25,10.64 | 16.53,11.03 16.23,11.33 | 18.41,13.25 18.41,13.34 18.05,13.7 v18.05,13.75 | v19.4,12.05 19.16,12.29 19.16,12.64 18.77,13.02 18.42,13.37 | v18.05,13.75 18.07,13.72 | 18.07,13.72 18.42,13.37 | v17.3,12.25 17.48,12.07 | 17.48,12.07 17.6,11.95 17.69,11.95 | v17.3,12.25 17.45,12.11 17.45,11.44 | 17.65,10.65 17.45,10.86 17.45,11.44 | 17.65,10.65 17.65,10.24 | 16.23,11.33 16.39,11.62 | 16.39,11.62 16.43,11.7 | 16.43,11.7 16.65,12.1 17.19,12.56 | 17.19,12.56 17.65,12.95 v17.3,12.25 | 18.86,10.9 18.86,11.35 18.95,11.45 | 17.65,10.65 17.86,10.45 18.44,10.45 | 18.44,10.45 18.52,10.53 | 18.52,10.53 18.86,10.86 18.86,10.9 | v18.15,11.15 18.15,11.65 | 18.15,11.65 17.48,12.07 | 18.15,11.65 18.52,10.53 | 18.15,11.65 18.16,11.64 18.61,11.64 18.95,11.3 | 18.15,11.65 17.7,12.1 17.22,12.59 17.19,12.56 | 18.15,11.65 17.75,12.06 17.75,12.21 | 17.75,12.21 16.8,13.15 17.65,13.53 18.07,13.72 | 18.15,11.65 16.43,11.7 | 18.15,11.65 16.53,11.03 | 17.75,12.21 17.75,12.64 18.08,12.97 | 18.42,13.37 18.42,13.32 18.08,12.97 | 18.15,11.65 v15.65,12.2 | v18.15,11.15 v19.4,12.05
  Bottom 0.254: 18.44,10.45 v19.4,12.05 | 18.05,10.4 v18.15,11.15 | v18.05,13.75 16.97,12.41 | 16.97,12.41 16.88,12.29 v17.3,12.25 | v15.65,12.2 16.97,12.41 | v15.65,12.2 16.39,11.62 | 18.04,12.09 18.08,12.97 | v51.2,12.95 48.85,10.6 v44.35,10.6
  Bottom 0.813: v19.4,12.05 18.04,12.09 17.7,12.1 | 18.77,13.02 v18.15,11.15 16.34,11.53 | v15.65,12.2 17.65,13.53
  other vias: 49.25,13.4
GNG
  pour Bottom: 15.15,12.2 15.4,12.2 17.65,14.45 20,12.1 17.8,9.9 17.4,9.9 15.15,12.15
LHP
  Top 0.254: IC2.9 28.7,5.02 29.87,5.02 31.29,6.44 31.29,8.89 33.9,11.5 39,11.5 42.98,15.48 C16.1
N$1
  Top 0.254: C2.2 31.81,16.38 Q1.2 31.85,16.24 30.62,15.01 21.62,15.01 IC1.5
N$2  (via drill 0.35)
  Top 0.254: v32.71,28.73 MK2.3 MK2.4
  Bottom 0.254: v32.71,28.73 33.41,27.4 33.41,26.3 33,25.89 24.15,25.89 SW1.1
N$3  (1 unrouted)
  Top 0.254: 25.98,23.55 S3.2 25.07,23.4 23.1,21.43 23.1,19.83 22.78,19.51 C3.2 22.78,17.86 21.63,16.71 | 21.63,16.43 19.91,14.72 IC1.7
N$4
  Top 0.254: C10.2 4.35,18.84 VREG-3V3.4
N$5
  Top 0.254: C7.2 20.5,18.83 20.5,17.58 19.87,16.95 R3.2 19.72,15.94 IC1.9
N$6
  Top 0.254: C16.2 46.67,14.95 R8.1 48.47,14.13 48.47,11.9 49.62,10.75 51.05,10.75 J2.3
N$7
  Top 0.254: R5.2 8.73,8.93 8.73,10.31 7.86,11.18 X1.D-
N$8
  Top 0.254: IC1.31 15.39,9.48 14.61,8.7 12.06,8.7 7.75,13.01 7.75,14.8 7.54,15.01 5.52,15.01 5.45,14.93 | X1.ID 7.11,9.88 5.84,9.88 5.48,10.24 5.48,12.3 5.33,12.45 5.33,14.82 5.45,14.93 | 5.45,14.93 5.45,14.95
N$9
  Top 0.254: IC1.32 15.74,9.13 14.76,8.15 11.81,8.15 10.4,8.36 R5.1
N$10
  Top 0.254: R6.2 8.09,7.71 8.09,10.22 7.78,10.53 X1.D+
N$11
  Top 0.254: IC1.33 16.09,8.78 14.91,7.59 R6.1
N$12
  Top 0.254: 20.27,1.98 20.2,1.9 FB1.2 21.72,1.9 C20.2 23.47,1.82 C19.2 23.68,1.77 28.6,1.77 IC2.14
N$13  (via drill 0.35)
  Top 0.254: IC1.44 23.33,7.48 23.92,7.48 R2.1 23.97,7.67 24.98,8.68 v24.95,8.71 | v30.7,10.75 32.22,10.75 33.48,12.01 35.98,12.01 S1.1
  Bottom 0.254: v24.95,8.71 25.45,9.21 29.36,9.21 30.7,10.55 v30.7,10.75
N$14
  Top 0.254: IC2.16 37.8,2.48 C21.1 37.9,2.53 C22.2
N$15  (via drill 0.35)
  Top 0.254: IC2.12 31.43,3.12 v31.65,2.9
  Bottom 0.254: v31.65,2.9 36.95,8.2 36.95,30.98 36.07,31.86 29.58,31.86 28.73,31 JP13.1
N$16  (via drill 0.35)
  Top 0.254: IC2.13 28.7,2.43 29.67,2.43 29.85,2.24 v30.85,2.24
  Bottom 0.254: v30.85,2.24 30.85,3.6 35.76,8.51 35.76,26.09 35.75,26.1 35.75,30.55 35.05,31.25 30,31.25 28.06,29.31 24.89,29.31 JP12.1
N$19
  Top 0.254: C4.2 27.13,19.44 Q1.1 26.53,15.64 21.62,15.64 21.53,15.57 21.48,15.57 IC1.6
N$25
  Top 0.254: R9.1 47.3,13.75 C17.2 45.57,4.47 43.55,2.45 J2.1
N$48
  Top 0.254: IC1.22 13.05,14.23 13.05,14.73 12.5,15.28 C38.1
RHP
  Top 0.254: IC2.10 30.07,4.42 31.74,6.1 31.74,8.57 34.02,10.85 40.25,10.85 43.03,13.63 C17.1
SWCLK
  Top 0.254: IC1.37 17.63,7.2 17.63,4.95 9.27,4.95 6.9,2.58 JP2.1
SWDIO
  Top 0.254: 16.45,8.41 IC1.34 15.09,7.06 10.53,7.06 10.27,6.8 8.7,6.8 4.43,2.53 JP3.1
VDD  (via drill 0.35)
  Top 0.152: MK1.3 4.79,28.32 4.84,28.32
  Top 0.254: C8.1 23.56,12.54 23,13.1 22.82,13.1 | 22.82,13.1 22.54,13.1 IC1.1 22.48,12.15 v22.6,12.15 22.6,11.5 | IC1.24 12.89,12.97 12.23,12.97 C6.1 v11.68,13.57 | v4.85,28.5 v4.84,28.49 4.84,28.32 | 22.82,13.1 v23.83,14.12 23.9,14.18 | IC1.36 16.66,7.22 C5.2 | IC1.48 22.14,11.5 22.6,11.5 | C11.2 1.93,20.75 VREG-3V3.5 | IC2.1 28.35,10.28 | 28.35,10.28 28.23,10.28 v27.2,11.3 | C14.2 26.6,4.8 27.52,5.72 IC2.8 28.7,5.77 29.67,5.77 30.8,6.91 30.8,9.45 30.9,9.55 v30.9,9.6 | v33.65,9.4 33.83,9.58 35.7,9.58 IC2.27 35.85,9.53 36.89,9.53 39.37,7.05 R4.1 R7.1 | C1.1 23.61,11.5 22.6,11.5 | C13.1 28.32,10.25 28.35,10.28 | v19.84,18 19.79,18.05 R3.1 | C15.2 47.75,17.55 v47.6,17.7 43.52,21.77 S1.2 | C18.1 7.72,29.82 C33.1 8.45,28.65 v8.45,25.8
  Bottom 0.254: 1.23,21.35 1.14,21.44 | C11.2 1.18,22.2 1.18,22.7 1.14,22.74 | 1.14,21.44 1.14,14.54 1.19,14.49 1.19,14.39 | 1.19,14.39 1.34,14.24 11.01,14.24 v11.68,13.57 | SW1.2 9.8,24.45 v8.45,25.8 7.11,25.8 6.98,25.93 | 4.8,28.55 v4.85,28.5 4.85,28.06 6.98,25.93 | 1.14,22.74 1.14,23.3 2.69,24.85 5.9,24.85 6.98,25.93 | JP4.1 12.8,2.53 13.1,2.83 13.1,4.4 13.43,4.72 15.18,4.72 16.52,6.07 C5.2 22.6,12.01 v22.6,12.15 | 1.14,22.74 1.14,21.44 | 1.19,14.39 1.19,13.31 8.21,6.29 8.21,1.95 8.85,1.31 10.01,1.31 11.23,2.53 JP4.1 | v30.9,9.6 33.35,9.6 33.65,9.3 v33.65,9.4 | JP4.1 12.67,2.53 13.97,1.23 17.68,1.23 18,1.55 | 18,1.55 FB1.1 | C1.1 26.47,10.57 v27.2,11.3 | v23.83,14.12 23.83,15.53 v22.78,16.58 21.41,17.95 19.85,17.95 19.84,17.96 v19.84,18 | 18,1.55 18.41,1.14 33.64,1.14 R4.1 39.55,9.65 42.56,12.66 43.62,12.66 44.07,13.11 44.07,14.17 45.01,15.11 46.01,15.11 46.61,15.71 46.61,16.71 v47.6,17.7
  other vias: 16.66,6.07 19.95,3.5 24.54,10.57 39.55,7.05

### Text on the board
tPlace: 100nF | B13 | B12 | A3 | A2 | A1 | Rout | Lout | 1UF | 4.7U | 2.2UF | LED | 100nF | 4.7U | 100nF | 22P | 22P | 470pF | 220UF | 100nF | 100nF | 100nF | 10K | 4K7R | 220UF | 4K7R | 100nF | 100nF | 22R | 100nF | 4K7R | 22R | 10K | 4K7R | 100nF | 100nF | 100nF | B8 | WM8731 | 10uF | LUMBERG Connector | SWDIO | SWCLK | GND | VDD | B9 | Ferrite | 10UF | 100nF